# EAGLE design 6LED_controller (EAGLE 8.7.1)
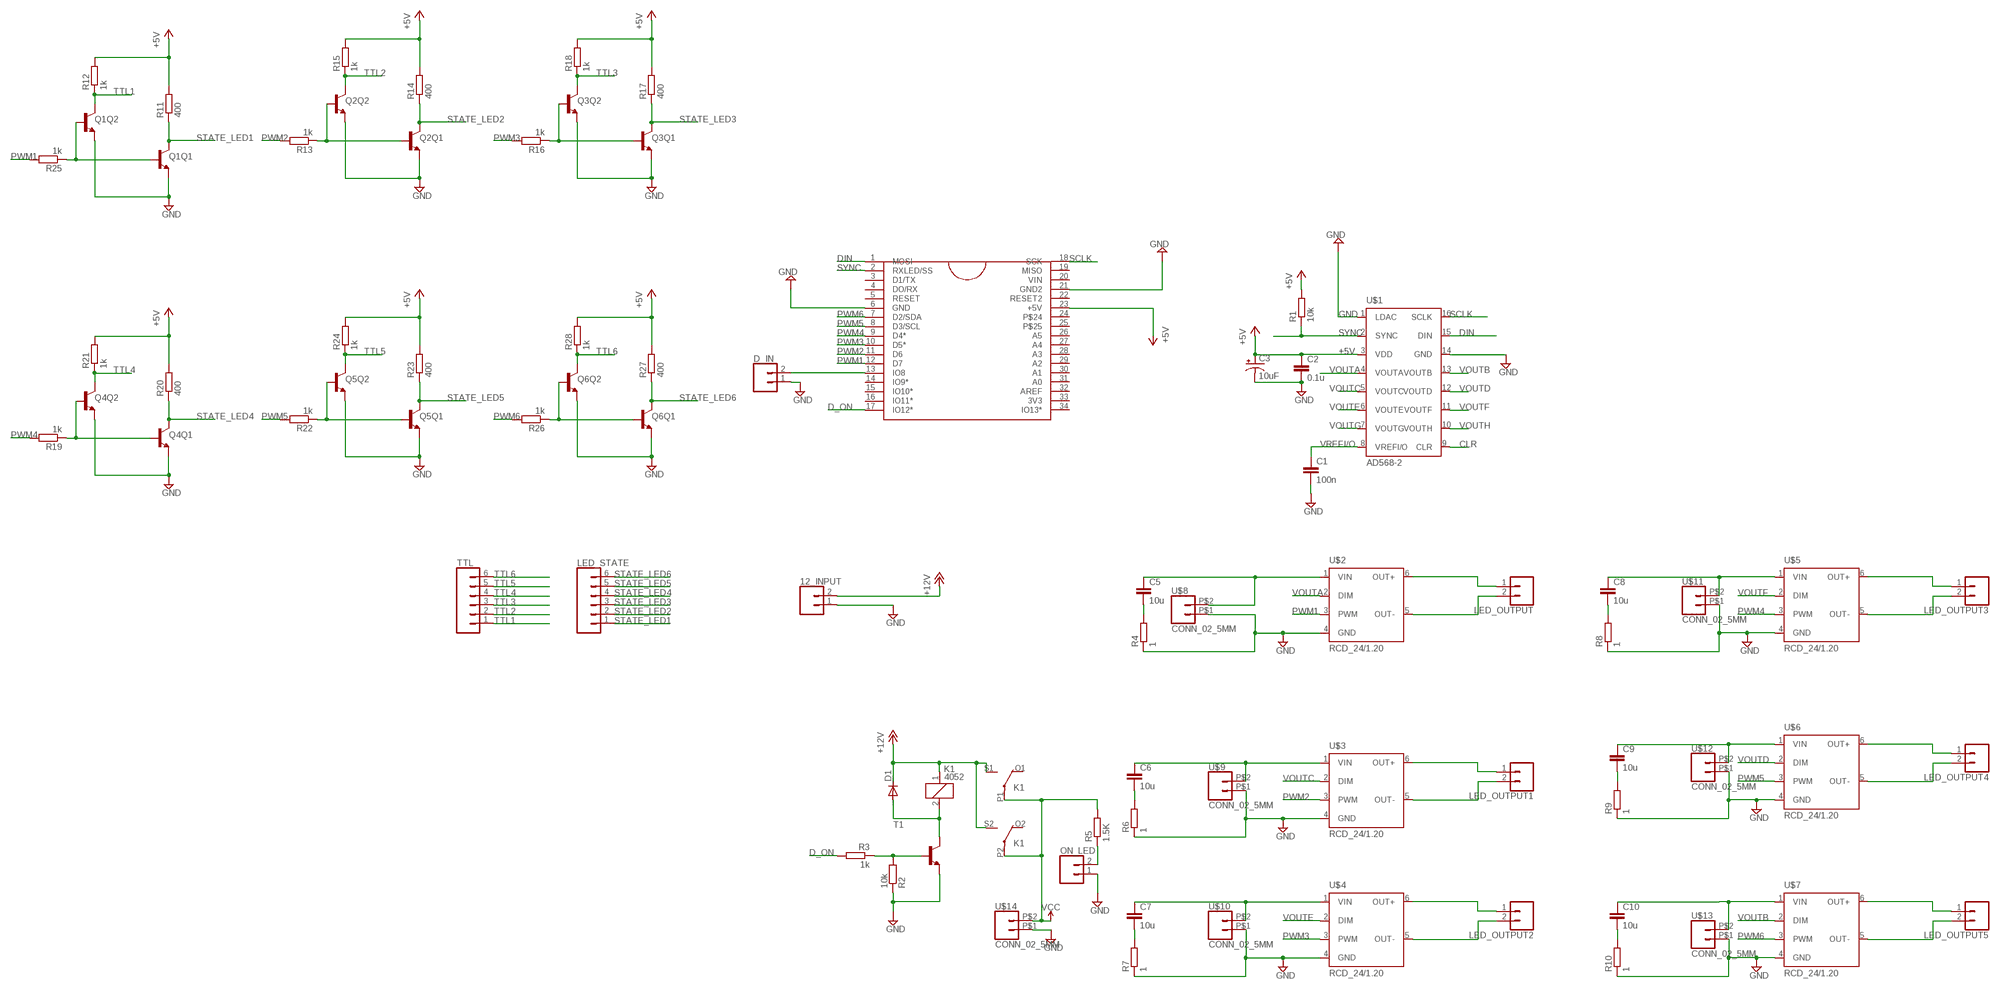
[diagram p0: schematic, sheet 1]

## Parts
12_INPUT  CONN_023.5MM  [SCREWTERMINAL-3.5MM-2]
C1  100n  C-EUC1206  [C1206]
C2  0.1u  C-EUC1206  [C1206]
C3  10uF  10UF-POLAR-EIA3528-20V-10%(TANT)  [EIA3528]
C5  10u  C-EUC1206  [C1206]
C6  10u  C-EUC1206  [C1206]
C7  10u  C-EUC1206  [C1206]
C8  10u  C-EUC1206  [C1206]
C9  10u  C-EUC1206  [C1206]
C10  10u  C-EUC1206  [C1206]
D1  DIODE-DO214AC  [DO214AC]
D_IN  CONN_02  [1X02]
K1  4052  [F4052]
LED_OUTPUT  CONN_023.5MM  [SCREWTERMINAL-3.5MM-2]
LED_OUTPUT1  CONN_023.5MM  [SCREWTERMINAL-3.5MM-2]
LED_OUTPUT2  CONN_023.5MM  [SCREWTERMINAL-3.5MM-2]
LED_OUTPUT3  CONN_023.5MM  [SCREWTERMINAL-3.5MM-2]
LED_OUTPUT4  CONN_023.5MM  [SCREWTERMINAL-3.5MM-2]
LED_OUTPUT5  CONN_023.5MM  [SCREWTERMINAL-3.5MM-2]
LED_STATE  CONN_06POLAR  [MOLEX-1X6]
ON_LED  CONN_02  [1X02]
Q1  TRANS_NPN_DUAL_NSM4002-MBT3904DW1T1  [SC70-6]
Q2  TRANS_NPN_DUAL_NSM4002-MBT3904DW1T1  [SC70-6]
Q3  TRANS_NPN_DUAL_NSM4002-MBT3904DW1T1  [SC70-6]
Q4  TRANS_NPN_DUAL_NSM4002-MBT3904DW1T1  [SC70-6]
Q5  TRANS_NPN_DUAL_NSM4002-MBT3904DW1T1  [SC70-6]
Q6  TRANS_NPN_DUAL_NSM4002-MBT3904DW1T1  [SC70-6]
R1  10k  R-EU_R1206  [R1206]
R2  10k  R-EU_R1206  [R1206]
R3  1k  R-EU_R0805  [R0805]
R4  1  R-EU_R2512  [R2512]
R5  1.5K  R-EU_R0805  [R0805]
R6  1  R-EU_R2512  [R2512]
R7  1  R-EU_R2512  [R2512]
R8  1  R-EU_R2512  [R2512]
R9  1  R-EU_R2512  [R2512]
R10  1  R-EU_R2512  [R2512]
R11  400  R-EU_R0805  [R0805]
R12  1k  R-EU_R0805  [R0805]
R13  1k  R-EU_R0805  [R0805]
R14  400  R-EU_R0805  [R0805]
R15  1k  R-EU_R0805  [R0805]
R16  1k  R-EU_R0805  [R0805]
R17  400  R-EU_R0805  [R0805]
R18  1k  R-EU_R0805  [R0805]
R19  1k  R-EU_R0805  [R0805]
R20  400  R-EU_R0805  [R0805]
R21  1k  R-EU_R0805  [R0805]
R22  1k  R-EU_R0805  [R0805]
R23  400  R-EU_R0805  [R0805]
R24  1k  R-EU_R0805  [R0805]
R25  1k  R-EU_R0805  [R0805]
R26  1k  R-EU_R0805  [R0805]
R27  400  R-EU_R0805  [R0805]
R28  1k  R-EU_R0805  [R0805]
T1  -NPN-SOT223  [SOT223]
TTL  CONN_06POLAR  [MOLEX-1X6]
U$1  AD568-2  [TSSOP-16]
U$2  RCD_24/1.20  [RCD-24/W/X3]
U$3  RCD_24/1.20  [RCD-24/W/X3]
U$4  RCD_24/1.20  [RCD-24/W/X3]
U$5  RCD_24/1.20  [RCD-24/W/X3]
U$6  RCD_24/1.20  [RCD-24/W/X3]
U$7  RCD_24/1.20  [RCD-24/W/X3]
U$8  CONN_02_5MM  [1X02_BIG_5MM]
U$9  CONN_02_5MM  [1X02_BIG_5MM]
U$10  CONN_02_5MM  [1X02_BIG_5MM]
U$11  CONN_02_5MM  [1X02_BIG_5MM]
U$12  CONN_02_5MM  [1X02_BIG_5MM]
U$13  CONN_02_5MM  [1X02_BIG_5MM]
U$14  CONN_02_5MM  [1X02_BIG_5MM]
U$20  ARDUINO_MICRO  [ARDUINO_MICRO_PADS]

## Nets
+5V: C2.1 C3.A(+) R1.2 R11.2 R12.2 R14.2 R15.2 R17.2 R18.2 R20.2 R21.2 R23.2 R24.2 R27.2 R28.2 U$1.3(VDD) U$20.23(+5V)
+12V: 12_INPUT.2 D1.C K1.1 K1.S1(2:S) K1.S2(3:S)
CLR: U$1.9(CLR)
D_ON: R3.2 U$20.17(IO12*)
DIN: U$1.15(DIN) U$20.1(MOSI)
GND: 12_INPUT.1 C1.2 C2.2 C3.C(-) D_IN.1 ON_LED.1 Q1.1(Q2:E) Q1.4(Q1:E) Q2.1(Q2:E) Q2.4(Q1:E) Q3.1(Q2:E) Q3.4(Q1:E) Q4.1(Q2:E) Q4.4(Q1:E) Q5.1(Q2:E) Q5.4(Q1:E) Q6.1(Q2:E) Q6.4(Q1:E) R2.1 R4.1 R6.1 R7.1 R8.1 R9.1 R10.1 T1.3(E) U$1.1(LDAC) U$1.14(GND) U$2.4(GND) U$3.4(GND) U$4.4(GND) U$5.4(GND) U$6.4(GND) U$7.4(GND) U$8.P$1 U$9.P$1 U$10.P$1 U$11.P$1 U$12.P$1 U$13.P$1 U$14.P$1 U$20.6(GND) U$20.21(GND2)
N$1: ON_LED.2 R5.1
N$2: LED_OUTPUT1.2 U$3.5(OUT-)
N$3: LED_OUTPUT1.1 U$3.6(OUT+)
N$4: C5.2 R4.2
N$5: LED_OUTPUT2.2 U$4.5(OUT-)
N$6: LED_OUTPUT.2 U$2.5(OUT-)
N$7: LED_OUTPUT.1 U$2.6(OUT+)
N$8: LED_OUTPUT2.1 U$4.6(OUT+)
N$9: Q1.2(Q2:B) Q1.5(Q1:B) R25.1
N$10: LED_OUTPUT3.2 U$5.5(OUT-)
N$11: LED_OUTPUT3.1 U$5.6(OUT+)
N$12: C6.2 R6.2
N$13: LED_OUTPUT4.2 U$6.5(OUT-)
N$14: D1.A K1.2 T1.4(C)
N$15: LED_OUTPUT4.1 U$6.6(OUT+)
N$16: R2.2 R3.1 T1.1(B)
N$17: LED_OUTPUT5.2 U$7.5(OUT-)
N$18: LED_OUTPUT5.1 U$7.6(OUT+)
N$19: C5.1 U$2.1(VIN) U$8.P$2
N$20: C6.1 U$3.1(VIN) U$9.P$2
N$21: C7.1 U$4.1(VIN) U$10.P$2
N$22: C8.1 U$5.1(VIN) U$11.P$2
N$23: C9.1 U$6.1(VIN) U$12.P$2
N$24: C10.1 U$7.1(VIN) U$13.P$2
N$25: Q2.2(Q2:B) Q2.5(Q1:B) R13.1
N$26: C7.2 R7.2
N$27: Q3.2(Q2:B) Q3.5(Q1:B) R16.1
N$28: C8.2 R8.2
N$29: Q4.2(Q2:B) Q4.5(Q1:B) R19.1
N$30: C9.2 R9.2
N$31: Q5.2(Q2:B) Q5.5(Q1:B) R22.1
N$32: C10.2 R10.2
N$33: Q6.2(Q2:B) Q6.5(Q1:B) R26.1
N$34: D_IN.2 U$20.13(IO8)
PWM1: R25.2 U$2.3(PWM) U$20.12(D7)
PWM2: R13.2 U$3.3(PWM) U$20.11(D6)
PWM3: R16.2 U$4.3(PWM) U$20.10(D5*)
PWM4: R19.2 U$5.3(PWM) U$20.9(D4*)
PWM5: R22.2 U$6.3(PWM) U$20.8(D3/SCL)
PWM6: R26.2 U$7.3(PWM) U$20.7(D2/SDA)
SCLK: U$1.16(SCLK) U$20.18(SCK)
STATE_LED1: LED_STATE.1 Q1.3(Q1:C) R11.1
STATE_LED2: LED_STATE.2 Q2.3(Q1:C) R14.1
STATE_LED3: LED_STATE.3 Q3.3(Q1:C) R17.1
STATE_LED4: LED_STATE.4 Q4.3(Q1:C) R20.1
STATE_LED5: LED_STATE.5 Q5.3(Q1:C) R23.1
STATE_LED6: LED_STATE.6 Q6.3(Q1:C) R27.1
SYNC: R1.1 U$1.2(SYNC) U$20.2(RXLED/SS)
TTL1: Q1.6(Q2:C) R12.1 TTL.1
TTL2: Q2.6(Q2:C) R15.1 TTL.2
TTL3: Q3.6(Q2:C) R18.1 TTL.3
TTL4: Q4.6(Q2:C) R21.1 TTL.4
TTL5: Q5.6(Q2:C) R24.1 TTL.5
TTL6: Q6.6(Q2:C) R28.1 TTL.6
VCC: K1.P1(2:P) K1.P2(3:P) R5.2 U$14.P$2
VOUTA: U$1.4(VOUTA) U$2.2(DIM)
VOUTB: U$1.13(VOUTB) U$7.2(DIM)
VOUTC: U$1.5(VOUTC) U$3.2(DIM)
VOUTD: U$1.12(VOUTD) U$6.2(DIM)
VOUTE: U$1.6(VOUTE) U$4.2(DIM)
VOUTF: U$1.11(VOUTF) U$5.2(DIM)
VOUTG: U$1.7(VOUTG)
VOUTH: U$1.10(VOUTH)
VREFI/O: C1.1 U$1.8(VREFI/O)
Unconnected: K1.O1(2:O) K1.O2(3:O) U$20.3(D1/TX) U$20.4(DO/RX) U$20.5(RESET) U$20.14(IO9*) U$20.15(IO10*) U$20.16(IO11*) U$20.19(MISO) U$20.20(VIN) U$20.22(RESET2) U$20.24 U$20.25 U$20.26(A5) U$20.27(A4) U$20.28(A3) U$20.29(A2) U$20.30(A1) U$20.31(A0) U$20.32(AREF) U$20.33(3V3) U$20.34(IO13*)

## Library data of the parts
12_INPUT LED_OUTPUT LED_OUTPUT1-LED_OUTPUT5 = SparkFun-Connectors:CONN_02: Multi connection point. Often used as Generic Header-pin footprint for 0.1 inch spaced/style header connections On any of the 0.1 inch spaced packages, you can populate with these: Break Away Headers - Straight <https://www.sparkfun.com/products/116> (PRT-00116) Break Away Male Headers - Right Angle <https://www.sparkfun.com/products/553> (PRT-00553) Female Headers <https://www.sparkfun.com/products/115> (PRT-00115) Break Away Headers - Machine Pin <https://www.sparkfun.com/products/117> (PRT-00117) Break Away Female Headers - Swiss Machine Pin <https://www.sparkfun.com/products/743> (PRT-00743) For SCREWTERMINALS and SPRING TERMINALS visit here: Screw Terimnals on SparkFun.com <https://www.sparkfun.com/search/results?term=Screw+Terminals> (5mm/3.5mm/2.54mm spacing) This device is also useful as a general connection point to wire up your design to another part of your project. Our various solder wires solder well into these plated through hole pads. Hook-Up Wire - Assortment (Stranded, 22 AWG) <https://www.sparkfun.com/products/11375> (PRT-11375) Hook-Up Wire - Assortment (Solid Core, 22 AWG) <https://www.sparkfun.com/products/11367> (PRT-11367) View the entire wire category on our website here <https://www.sparkfun.com/categories/141> Special notes: Molex polarized connector foot print use with: PRT-08233 with associated crimp pins and housings. 2.54_SCREWTERM for use with PRT-10571. 3.5mm Screw Terminal footprints for PRT-08084 5mm Screw Terminal footprints for use with PRT-08432; PROD_ID: CONN-08399
C1 C2 C5-C10 = rcl:C-EU: CAPACITOR, European symbol; SPICEPREFIX: C
C3 = SparkFun-Capacitors:10UF-POLAR: 10.0µF polarized capacitors A capacitor is a passive two-terminal electrical component used to store electrical energy temporarily in an electric field.; PROD_ID: CAP-08063
D1 = diode:DIODE-: DIODE
D_IN ON_LED = SparkFun-Connectors:CONN_02: Multi connection point. Often used as Generic Header-pin footprint for 0.1 inch spaced/style header connections On any of the 0.1 inch spaced packages, you can populate with these: Break Away Headers - Straight <https://www.sparkfun.com/products/116> (PRT-00116) Break Away Male Headers - Right Angle <https://www.sparkfun.com/products/553> (PRT-00553) Female Headers <https://www.sparkfun.com/products/115> (PRT-00115) Break Away Headers - Machine Pin <https://www.sparkfun.com/products/117> (PRT-00117) Break Away Female Headers - Swiss Machine Pin <https://www.sparkfun.com/products/743> (PRT-00743) For SCREWTERMINALS and SPRING TERMINALS visit here: Screw Terimnals on SparkFun.com <https://www.sparkfun.com/search/results?term=Screw+Terminals> (5mm/3.5mm/2.54mm spacing) This device is also useful as a general connection point to wire up your design to another part of your project. Our various solder wires solder well into these plated through hole pads. Hook-Up Wire - Assortment (Stranded, 22 AWG) <https://www.sparkfun.com/products/11375> (PRT-11375) Hook-Up Wire - Assortment (Solid Core, 22 AWG) <https://www.sparkfun.com/products/11367> (PRT-11367) View the entire wire category on our website here <https://www.sparkfun.com/categories/141> Special notes: Molex polarized connector foot print use with: PRT-08233 with associated crimp pins and housings. 2.54_SCREWTERM for use with PRT-10571. 3.5mm Screw Terminal footprints for PRT-08084 5mm Screw Terminal footprints for use with PRT-08432
K1 = relay:4052: RELAY 2 x switch, Finder; OC_FARNELL: unknown; OC_NEWARK: unknown
LED_STATE TTL = SparkFun-Connectors:CONN_06: Multi connection point. Often used as Generic Header-pin footprint for 0.1 inch spaced/style header connections On any of the 0.1 inch spaced packages, you can populate with these: Break Away Headers - Straight <https://www.sparkfun.com/products/116> (PRT-00116) Break Away Male Headers - Right Angle <https://www.sparkfun.com/products/553> (PRT-00553) Female Headers <https://www.sparkfun.com/products/115> (PRT-00115) Break Away Headers - Machine Pin <https://www.sparkfun.com/products/117> (PRT-00117) Break Away Female Headers - Swiss Machine Pin <https://www.sparkfun.com/products/743> (PRT-00743) Arduino Stackable Header - 6 Pin <https://www.sparkfun.com/products/9280> (PRT-09280) For SCREWTERMINALS and SPRING TERMINALS visit here: Screw Terimnals on SparkFun.com <https://www.sparkfun.com/search/results?term=Screw+Terminals> (5mm/3.5mm/2.54mm spacing) This device is also useful as a general connection point to wire up your design to another part of your project. Our various solder wires solder well into these plated through hole pads. Hook-Up Wire - Assortment (Stranded, 22 AWG) <https://www.sparkfun.com/products/11375> (PRT-11375) Hook-Up Wire - Assortment (Solid Core, 22 AWG) <https://www.sparkfun.com/products/11367> (PRT-11367) View the entire wire category on our website here <https://www.sparkfun.com/categories/141>
Q1-Q6 = SparkFun-DiscreteSemi:TRANS_NPN_DUAL_NSM4002: Dual NPN Transistors in Single Package The MBT3904W1 puts two general purpose 3904 NPN transistors in a single package. Datasheet <http://www.onsemi.com/pub_link/Collateral/MBT3904DW1T1-D.PDF> SparkFun Products: SparkFun ESP32 Thing <https://www.sparkfun.com/products/13907>; PROD_ID: TRANS-13337
R1-R28 = rcl:R-EU_: RESISTOR, European symbol; SPICEPREFIX: R
T1 = transistor-neu-to92:*-NPN-: NPN Transistror
U$1 = opto_stimulation:AD568-2
U$2-U$7 = opto_stimulation:RCD_24/1.20
U$8-U$14 = SparkFun-Connectors:CONN_02_5MM
U$20 = opto_stimulation:ARDUINO_MICRO; SPICEPREFIX: X

## Board
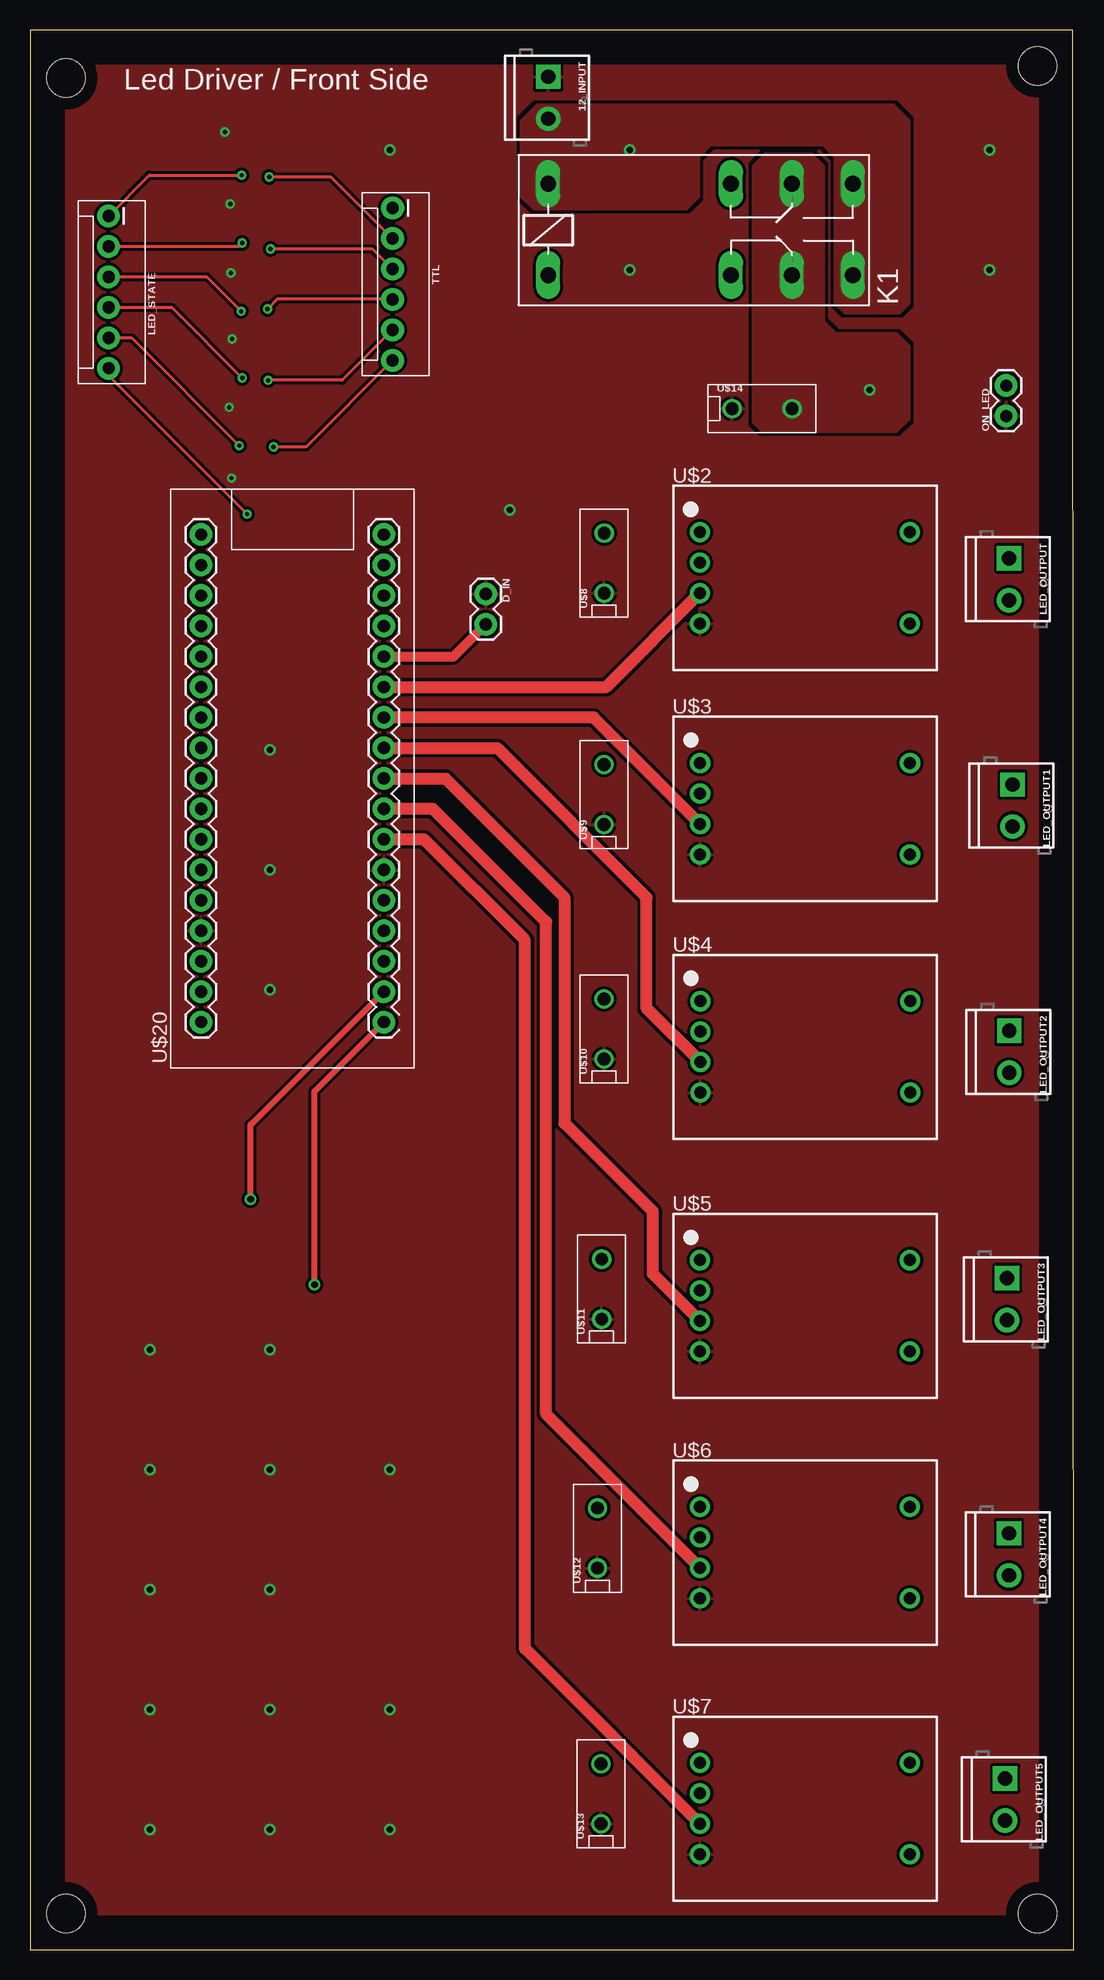
[diagram p1: board, top side]
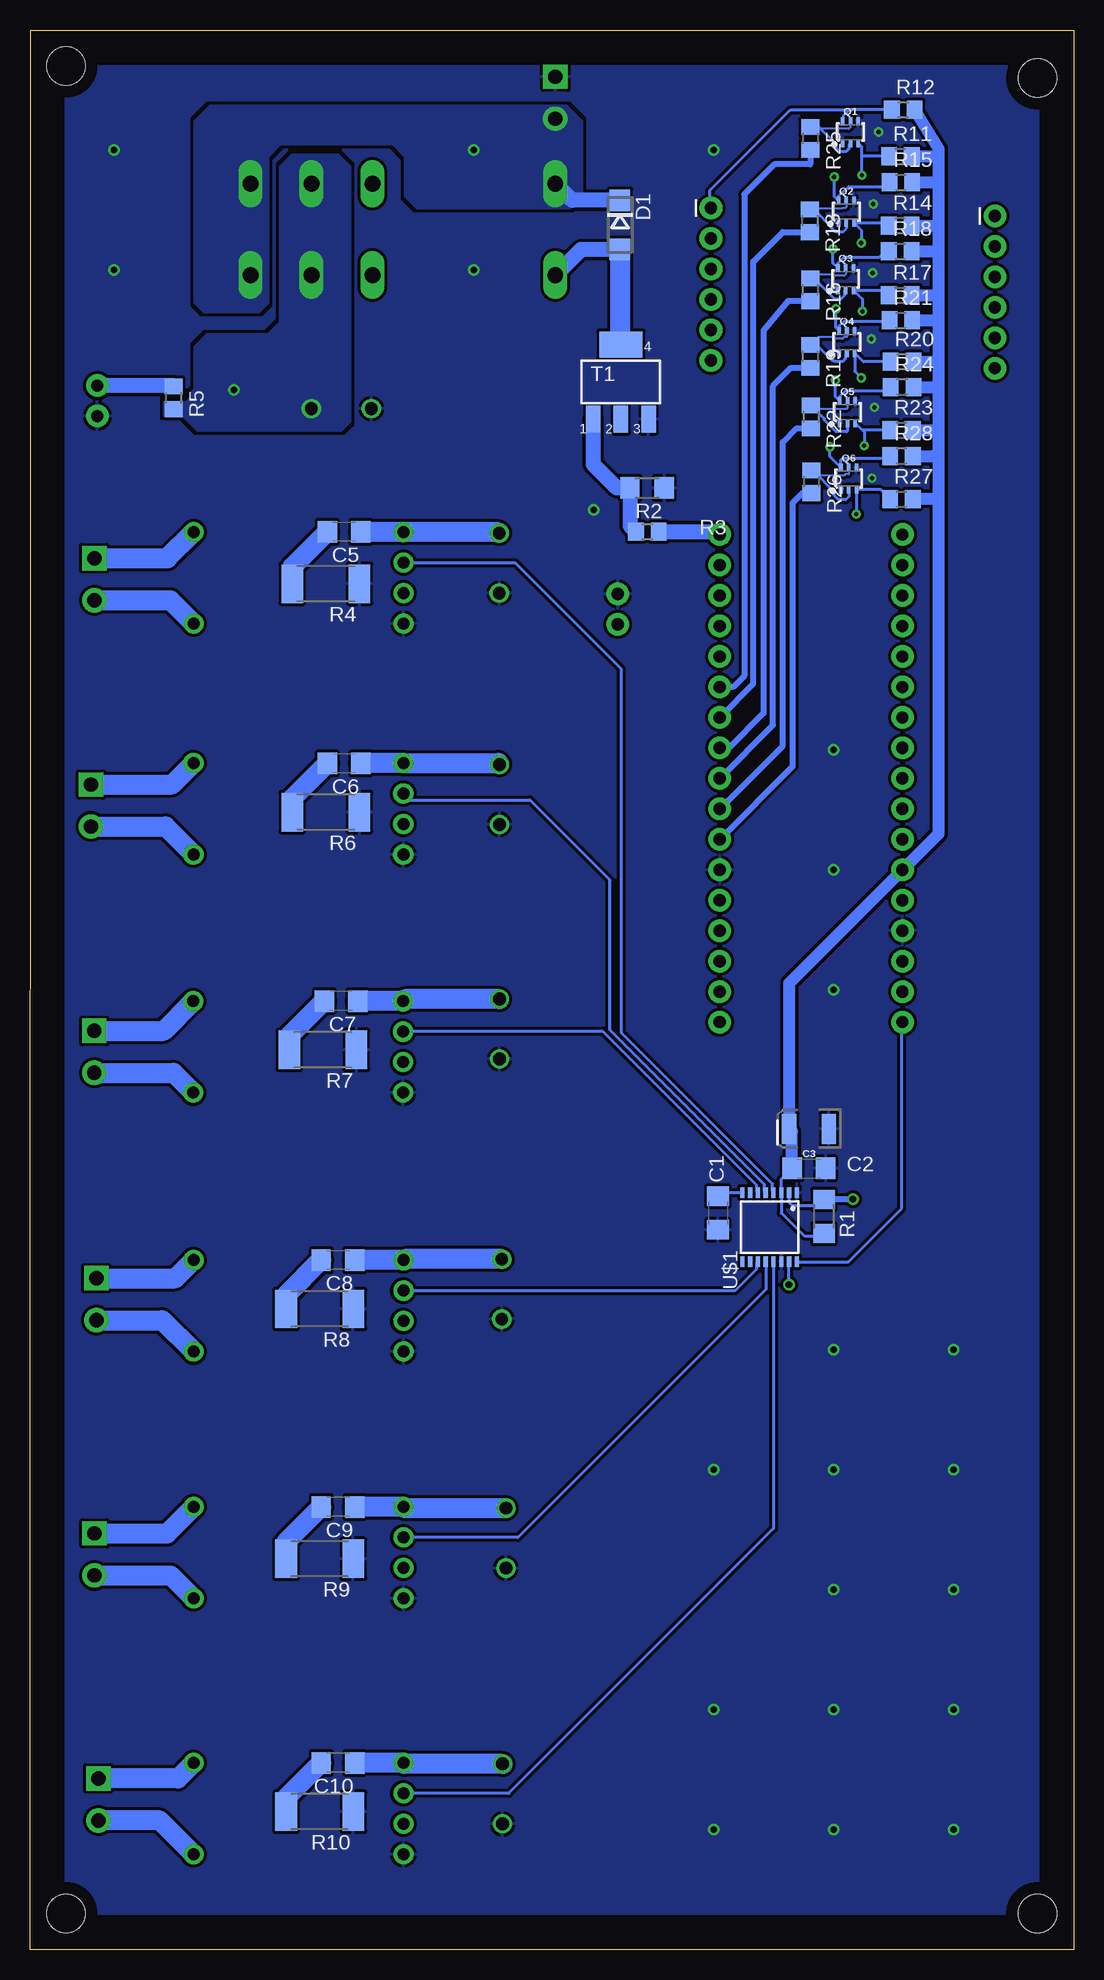
[diagram p2: board, bottom side, seen from below]

Size 87 x 160 mm. Coordinates in mm from the lower left corner, seen from the top.
Outline: 0,0 87,0 86.95,160 0,160 0,0
Copper layers (1*16): Top 0.035mm / dielectric 1.5mm / Bottom 0.035mm
Design rules "default *": minimum track width 6mil, minimum drill 0.35mm, track to track 10mil, track to pad 10mil, pad to pad 10mil, via to via 10mil, smd to smd 10mil, copper to edge 40mil, drill to drill 6mil, minimum pad ring 10mil, minimum via ring 8mil, stop-mask expansion 4mil, vias tented up to drill 0mil, thermal gap 10mil
Holes 3.2 mm at 3,3 84,3 3,156 84,157

### Footprints (pad centres in the part's own frame; a part is rotated, then mirrored left to right if it is on the bottom)
SCREWTERMINAL-3.5MM-2 = drill 1.2 pad 2.032 square: 1 0,0 | drill 1.2 pad 2.032: 2 3.5,0
C1206 = smd 1.6 x 1.8: 1 -1.4,0; 2 1.4,0
EIA3528 = smd 1.2 x 2.5: A 1.65,0; C -1.65,0
DO214AC = smd 1.8 x 1.7: A 2.05,0; C -2.05,0
1X02 = drill 1.016 pad 1.88: 1 0,0; 2 2.54,0
F4052 = drill 1.321 long: 1 -3.81,3.81; 2 -3.81,-3.81; O1 11.43,-3.81; O2 11.43,3.81; P1 16.51,-3.81; P2 16.51,3.81; S1 21.59,-3.81; S2 21.59,3.81
MOLEX-1X6 = drill 1.016 pad 1.88: 1 0,0; 2 2.54,0; 3 5.08,0; 4 7.62,0; 5 10.16,0; 6 12.7,0
SC70-6 = smd 0.3 x 0.66: 1 -0.65,-0.92; 2 0,-0.92; 3 0.65,-0.92; 4 0.65,0.92; 5 0,0.92; 6 -0.65,0.92
R1206 = smd 1.6 x 1.803: 1 -1.422,0; 2 1.422,0
R0805 = smd 1.3 x 1.5: 1 -0.95,0; 2 0.95,0
R2512 = smd 1.8 x 3.2: 1 -2.8,0; 2 2.8,0
SOT223 = smd 1.219 x 2.235: 1 -2.311,-3.099; 2 0,-3.099; 3 2.311,-3.099 | smd 3.6 x 2.2: 4 0,3.099
TSSOP-16 = smd 0.9 x 0.35: 1 -2.875,2.275; 2 -2.875,1.625; 3 -2.875,0.975; 4 -2.875,0.325; 5 -2.875,-0.325; 6 -2.875,-0.975; 7 -2.875,-1.625; 8 -2.875,-2.275; 9 2.875,-2.275; 10 2.875,-1.625; 11 2.875,-0.975; 12 2.875,-0.325; 13 2.875,0.325; 14 2.875,0.975; 15 2.875,1.625; 16 2.875,2.275
RCD-24/W/X3 = drill 1 pad 1.676: 1 -8.75,3.81; 2 -8.75,1.27; 3 -8.75,-1.27; 4 -8.75,-3.81; 5 8.75,-3.81; 6 8.75,3.81
1X02_BIG_5MM = drill 1.067: P$1 0,0; P$2 5,0
ARDUINO_MICRO_PADS = drill 1.016 pad 1.88: 1 0,0; 2 2.54,0; 3 5.08,0; 4 7.62,0; 5 10.16,0; 6 12.7,0; 7 15.24,0; 8 17.78,0; 9 20.32,0; 10 22.86,0; 11 25.4,0; 12 27.94,0; 13 30.48,0; 14 33.02,0; 15 35.56,0; 16 38.1,0; 17 40.64,0; 18 0,15.24; 19 2.54,15.24; 20 5.08,15.24; 21 7.62,15.24; 22 10.16,15.24; 23 12.7,15.24; 24 15.24,15.24; 25 17.78,15.24; 26 20.32,15.24; 27 22.86,15.24; 28 25.4,15.24; 29 27.94,15.24; 30 30.48,15.24; 31 33.02,15.24; 32 35.56,15.24; 33 38.1,15.24; 34 40.64,15.24

### Placement (x,y rotation side)
12_INPUT  43.2,156.1 270 top
C1  29.65,61.39 270 bottom
C2  22.07,65.11 0 bottom
C3  22.05,68.41 180 bottom
C5  60.81,118.17 180 bottom
C6  60.81,98.86 180 bottom
C7  61.06,79.05 180 bottom
C8  61.32,57.46 180 bottom
C9  61.32,36.89 180 bottom
C10  61.32,15.55 180 bottom
D1  37.82,143.75 270 bottom
D_IN  38,113 270 top
K1  47.02,143.38 0 top
LED_OUTPUT  81.63,115.97 270 top
LED_OUTPUT1  81.92,97.11 270 top
LED_OUTPUT2  81.64,76.57 270 top
LED_OUTPUT3  81.47,55.95 270 top
LED_OUTPUT4  81.61,34.68 270 top
LED_OUTPUT5  81.31,14.26 270 top
LED_STATE  6.55,144.5 270 top
ON_LED  81.38,127.82 90 top
Q1  18.6,151.5 0 bottom
Q2  18.95,144.85 0 bottom
Q3  19,139.25 0 bottom
Q4  18.9,134 0 bottom
Q5  18.85,128.15 0 bottom
Q6  18.75,122.6 0 bottom
R1  20.8,61.1 270 bottom
R2  35.55,121.83 180 bottom
R3  35.53,118.18 0 bottom
R4  62.33,113.85 180 bottom
R5  75.03,129.34 270 bottom
R6  62.33,94.8 180 bottom
R7  62.59,74.99 180 bottom
R8  62.84,53.4 180 bottom
R9  62.84,32.57 180 bottom
R10  62.84,11.49 180 bottom
R11  14.43,149.47 0 bottom
R12  14.2,153.35 0 bottom
R13  22,144.1 270 bottom
R14  14.45,143.7 0 bottom
R15  14.4,147.3 0 bottom
R16  21.95,138.35 270 bottom
R17  14.45,137.9 0 bottom
R18  14.45,141.55 0 bottom
R19  21.95,132.8 270 bottom
R20  14.3,132.35 0 bottom
R21  14.4,135.8 0 bottom
R22  21.9,127.75 270 bottom
R23  14.35,126.65 0 bottom
R24  14.3,130.25 0 bottom
R25  21.94,150.96 270 bottom
R26  21.85,122.35 270 bottom
R27  14.35,120.9 0 bottom
R28  14.35,124.5 0 bottom
T1  37.74,130.67 0 bottom
TTL  30.23,145.16 270 top
U$1  25.33,60.2 270 bottom
U$2  64.62,114.33 0 top
U$3  64.62,95.09 0 top
U$4  64.64,75.23 0 top
U$5  64.62,53.65 0 top
U$6  64.62,33.08 0 top
U$7  64.62,11.74 0 top
U$8  47.87,113.06 90 top
U$9  47.86,93.78 90 top
U$10  47.86,74.22 90 top
U$11  47.66,52.54 90 top
U$12  47.32,31.78 90 top
U$13  47.6,10.47 90 top
U$14  58.54,128.44 0 top
U$20  29.5,77.3 90 top

### Tracks (layer width: path | path; a pad name or v marks a point on that pad's centre or on a via)
+5V
  Bottom 0.254: R1.2 20.98,59.49 22.46,59.49 24.36,61.4 U$1.3 24.36,64.22 C2.1
  Bottom 1.016: C2.1 23.47,68.17 C3.A 23.7,80.56 U$20.23 11.25,93.01 11.25,120.95 | 11.25,120.95 11.25,124.9 | 11.25,124.9 11.25,126.55 | 11.25,126.55 11.25,130.5 | 11.25,130.5 11.25,132.1 | 11.25,132.1 11.25,136.1 | 11.25,136.1 11.25,138.05 | 11.25,138.05 11.25,141.6 | 11.25,141.6 11.25,143.5 | 11.25,143.5 11.25,147.35 | 11.25,147.35 11.25,149.4 | 11.25,149.4 11.25,150.1 R12.2 | R27.2 13.35,120.95 11.25,120.95 | R28.2 11.65,124.5 11.25,124.9 | R23.2 11.35,126.65 11.25,126.55 | R24.2 11.5,130.25 11.25,130.5 | R20.2 11.5,132.35 11.25,132.1 | R21.2 11.55,135.8 11.25,136.1 | R17.2 11.4,137.9 11.25,138.05 | R18.2 11.3,141.55 11.25,141.6 | R14.2 11.45,143.7 11.25,143.5 | R15.2 11.3,147.3 11.25,147.35 | R11.2 11.32,149.47 11.25,149.4
+12V  (via drill 0.55)
  Bottom 1.27: D1.C 41.81,145.8 K1.1
  other vias: 50,150
  pour Bottom (isolate 0.61, no thermals): 72.49,136.45 73.26,137.22 73.26,137.47 73.26,152.46 71.99,153.73 42.27,153.73 41,152.46 41,146.11 42.01,145.09 54.71,145.09 55.73,146.11 55.73,149.41 56.75,150.42 66.14,150.42 67.16,149.41 67.16,137.22 67.92,136.45 68.18,136.45
  pour Top (no thermals): 41,146.11 42.01,145.09 54.71,145.09 55.73,146.11 55.73,149.41 56.75,150.42 66.14,150.42 67.16,149.41 67.16,137.22 67.92,136.45 72.49,136.45 73.26,137.22 73.26,152.46 71.99,153.73 42.27,153.73 41,152.46
D_ON
  Bottom 1.27: R3.2 29.74,118.18 U$20.17
DIN  (via drill 0.55)
  Top 0.508: v23.73,55.43 23.73,71.53 U$20.1
  Bottom 0.254: v23.73,55.43 23.71,55.44 U$1.15
GND  (via drill 0.35, 0.55)
  Bottom 0.254: 19.28,121.8 Q6.1
  other vias: 20,90 20,80 20,50 20,40 20,30 20,20 20,10 30,10 30,20 30,40 80,140 80,150 16.8,122.65 16.6,128.55 16.85,134.25 16.75,139.75 16.7,145.5 16.25,151.5 20,100 10,50 10,40 10,30 10,20 10,10 30,150 50,140 40,120
  pour Top (rank 2): 3,157 3,3 84,3 84,157
  pour Bottom (rank 2): 3,157 3,3 84,3 84,157
N$1
  Bottom 1.27: R5.1 75.1,130.36 ON_LED.2
N$2
  Bottom 1.651: LED_OUTPUT1.2 75.7,93.61 U$3.5
N$3
  Bottom 1.651: LED_OUTPUT1.1 75.16,97.11 U$3.6
N$4
  Bottom 1.651: C5.2 65.13,115.24 R4.2
N$5
  Bottom 1.651: LED_OUTPUT2.2 75.04,73.07 U$4.5
N$6
  Bottom 1.651: LED_OUTPUT.2 75.31,112.47 U$2.5
N$7
  Bottom 1.651: LED_OUTPUT.1 75.54,115.97 U$2.6
N$8
  Bottom 1.651: LED_OUTPUT2.1 75.86,76.57 U$4.6
N$9
  Bottom 0.152: Q1.5 18.6,151.89 18.73,151.76 21.79,151.76 R25.1
  Bottom 0.254: Q1.2 18.72,150.46 18.72,150.09 18.94,149.87 19.13,149.87 19.15,149.85 19.17,149.87 19.56,149.87 19.78,150.09 19.78,150.48 21.21,151.91 R25.1
N$10
  Bottom 1.651: LED_OUTPUT3.2 75.98,52.45 U$5.5
N$11
  Bottom 1.651: LED_OUTPUT3.1 74.88,55.95 U$5.6
N$12
  Bottom 1.651: C6.2 65.13,95.94 R6.2
N$13
  Bottom 1.651: LED_OUTPUT4.2 75.29,31.18 U$6.5
N$14
  Bottom 1.27: D1.A 41.08,141.7 K1.2
  Bottom 1.651: D1.A 37.82,133.85 T1.4
N$15
  Bottom 1.651: LED_OUTPUT4.1 75.57,34.68 U$6.6
N$16
  Bottom 1.27: T1.1 40.05,123.8 38.1,121.85 36.99,121.85 R2.2 36.97,118.67 R3.1
N$17
  Bottom 1.651: U$7.5 76.2,10.76 LED_OUTPUT5.2
N$18
  Bottom 1.651: U$7.6 74.66,14.26 LED_OUTPUT5.1
N$19
  Bottom 1.651: U$8.P$2 47.95,118.14 U$2.1 59.39,118.14 C5.1
N$20
  Bottom 1.651: C6.1 59.37,98.9 U$3.1 47.97,98.9 U$9.P$2
N$21
  Bottom 1.651: U$10.P$2 55.71,79.22 U$4.1 C7.1
N$22
  Bottom 1.651: C8.1 U$5.1 55.79,57.54 U$11.P$2
N$23
  Bottom 1.651: C9.1 U$6.1 55.77,36.78 U$12.P$2
N$24
  Bottom 1.651: C10.1 U$7.1 55.79,15.47 U$13.P$2
N$25
  Bottom 0.152: 21.94,145.11 R13.1 | Q2.5 18.95,145.24 19.03,145.17 19.26,145.17 19.31,145.11 21.81,145.11 21.88,145.18
  Bottom 0.254: Q2.2 18.95,143.45 19.25,143.15 19.75,143.15 19.82,143.22 19.91,143.22 20.13,143.44 20.13,143.53 21.53,144.93 21.88,144.93 | 21.88,144.93 R13.1 21.88,145.18 21.88,144.93
N$26
  Bottom 1.651: C7.2 65.39,76.13 R7.2
N$27
  Bottom 0.152: Q3.5 19,139.63 19.12,139.51 19.94,139.51 20.03,139.6 21.65,139.6 R16.1
  Bottom 0.254: Q3.2 19.12,138.21 19.12,137.84 19.41,137.55 19.9,137.55 21.65,139.3 R16.1
N$28
  Bottom 1.651: C8.2 65.64,54.54 R8.2
N$29
  Bottom 0.152: Q4.5 18.9,134.4 19.13,134.4 19.26,134.26 19.84,134.26 19.97,134.4 21.3,134.4 R19.1
  Bottom 0.254: Q4.2 19.02,132.96 19.02,132.59 19.24,132.37 19.86,132.37 19.89,132.4 20.05,132.4 21.4,133.75 R19.1
N$30
  Bottom 1.651: C9.2 65.64,33.96 R9.2
N$31
  Bottom 0.152: Q5.5 18.85,128.5 18.94,128.41 21.61,128.41 R22.1
  Bottom 0.254: Q5.2 18.85,126.6 18.93,126.52 19.81,126.52 20.77,127.48 20.77,127.61 20.99,127.83 21.03,127.83 R22.1
N$32
  Bottom 1.651: C10.2 65.64,12.63 R10.2
N$33
  Bottom 0.152: Q6.5 18.75,122.97 19.01,122.97 19.11,122.86 21.33,122.86 21.77,123.3
  Bottom 0.254: Q6.2 18.75,121.1 19,120.85 19.59,120.85 19.93,121.19 19.93,121.48 21.75,123.3 21.77,123.3 R26.1
N$34
  Top 0.813: U$20.13 35.32,107.78 D_IN.2
PWM1
  Top 1.016: U$2.3 48.04,105.24 U$20.12
  Bottom 0.508: R25.2 21.95,148.8 24.95,148.8 27.45,146.3 27.45,106.15 28.36,105.24 U$20.12
PWM2
  Top 1.016: U$3.3 46.99,102.7 U$20.11
  Bottom 0.508: U$20.11 26.69,105.51 26.69,140.7 24.24,143.15 R13.2
PWM3
  Top 0.254: U$20.10 29.69,100.32 29.69,100.13
  Top 1.016: 29.53,100.13 29.69,100.13 38.97,100.13 51.41,87.69 51.41,78.44 U$4.3
  Bottom 0.508: R16.2 23.8,137.4 25.85,134.95 25.85,103.05 28.74,100.16 U$20.10
PWM4
  Top 0.254: U$20.9 29.69,97.78 29.69,97.59
  Top 1.016: 29.53,97.59 29.69,97.59 34.65,97.59 44.55,87.69 44.55,68.89 51.92,61.52 51.92,56.33 U$5.3
  Bottom 0.508: U$20.9 25.05,102.07 25.05,130.35 23.55,131.85 R19.2
PWM5
  Top 1.016: U$20.8 33.6,95.08 43.03,85.65 43.03,44.65 U$6.3
  Bottom 0.508: U$20.8 24.25,100.33 24.25,125.65 23.1,126.8 R22.2
PWM6
  Top 1.016: U$20.7 32.84,92.54 41.25,84.13 41.25,25.09 U$7.3
  Bottom 0.508: U$20.7 23.4,98.64 23.4,120.6 22.6,121.4 R26.2
SCLK
  Bottom 0.254: U$1.16 18.78,57.33 14.33,61.78 14.33,77.23 U$20.18
STATE_LED1  (via drill 0.35)
  Top 0.254: LED_STATE.1 9.95,147.9 v17.65,147.9
  Bottom 0.254: Q1.3 17.65,150.28 17.65,149.45 | v17.65,147.9 17.65,149.45 | R11.1 17.63,149.47 17.65,149.45
STATE_LED2  (via drill 0.35)
  Top 0.254: LED_STATE.2 17.41,141.96 v17.7,142.25
  Bottom 0.254: v17.7,142.25 17.7,143.33 Q2.3 15.63,143.93 R14.1
STATE_LED3  (via drill 0.35)
  Top 0.254: LED_STATE.3 14.73,139.42 v17.6,136.55
  Bottom 0.254: v17.6,136.55 17.6,137.58 Q3.3 15.83,138.33 R17.1
STATE_LED4  (via drill 0.35)
  Top 0.254: LED_STATE.4 11.82,136.88 v17.7,131
  Bottom 0.254: v17.7,131 18.25,131.55 Q4.3 17.52,132.35 R20.1
STATE_LED5  (via drill 0.35)
  Top 0.254: LED_STATE.5 8.46,134.34 v17.45,125.35
  Bottom 0.254: v17.45,125.35 17.45,126.48 Q5.3 17.62,126.65 R23.1
STATE_LED6  (via drill 0.35)
  Top 0.254: LED_STATE.6 6.55,131.2 v18.1,119.65
  Bottom 0.254: v18.1,119.65 Q6.3 16.08,121.68 R27.1
SYNC  (via drill 0.55)
  Top 0.508: v18.39,62.54 18.39,68.73 U$20.2
  Bottom 0.254: U$1.2 23.71,62.27 23.47,62.03 21.29,62.03 R1.1
  Bottom 0.508: v18.39,62.54 20.78,62.54 R1.1
TTL1
  Bottom 0.254: Q1.6 19.23,152.44 19.23,152.81 18.69,153.35 | R12.1 18.45,153.35 18.69,153.35 | TTL.1 30.3,145.23 30.3,146.65 23.6,153.35 18.69,153.35
TTL2  (via drill 0.35)
  Top 0.254: TTL.2 25.1,147.75 v19.95,147.75
  Bottom 0.254: v19.95,147.75 19.95,146.12 Q2.6 19.6,146.14 19.26,146.48 19.22,146.48 18.75,146.95 15.7,146.95 R15.1
TTL3  (via drill 0.35)
  Top 0.254: TTL.3 28.56,141.75 v20.05,141.75
  Bottom 0.254: v20.05,141.75 20.05,140.57 Q3.6 19.65,140.55 19.15,141.05 16.2,141.05 15.7,141.55 R18.1
TTL4  (via drill 0.35)
  Top 0.254: TTL.4 20.59,137.54 v19.8,136.75
  Bottom 0.254: v19.8,136.75 19.8,135.17 Q4.6 19.55,135.3 19.1,135.75 15.4,135.75 R21.1
TTL5  (via drill 0.35)
  Top 0.254: TTL.5 26.03,130.8 v19.85,130.8
  Bottom 0.254: v19.85,130.8 19.85,129.42 Q5.6 19.48,129.09 19.48,129.46 18.99,129.95 15.55,129.95 R24.1
TTL6  (via drill 0.35)
  Top 0.254: TTL.6 23.02,125.25 v20.3,125.25
  Bottom 0.254: v20.3,125.25 20.3,124.42 Q6.6 19.4,124.15 19.25,124.3 15.5,124.3 R28.1
VCC  (via drill 0.55)
  other vias: 70,130
  pour Bottom (isolate 0.61, no thermals): 61.32,149.66 60.3,148.65 60.3,127.31 61.06,126.55 73,126.55 74.27,127.82 75.8,127.82 75.8,129.09 74.27,129.09 73.26,130.1 73.26,133.66 72.24,134.68 67.16,134.68 66.14,135.69 66.14,148.65 65.13,149.66
  pour Top (no thermals): 60.3,148.65 61.32,149.66 65.13,149.66 66.14,148.65 66.14,135.69 67.16,134.68 72.24,134.68 73.26,133.66 73.26,127.56 72.24,126.55 61.06,126.55 60.3,127.31
VOUTA
  Bottom 0.254: U$2.2 46.56,115.6 37.7,106.74 37.7,76.41 25.1,63.82 25.1,63.17 U$1.4
VOUTB
  Bottom 0.254: U$1.13 25.01,35.09 47.09,13.01 U$7.2
VOUTC
  Bottom 0.254: U$3.2 55.33,95.81 45.32,95.81 38.64,89.14 38.64,76.64 25.75,63.75 25.75,63.17 U$1.5
VOUTD
  Bottom 0.254: U$1.12 25.66,55.02 46.33,34.35 U$6.2
VOUTE
  Bottom 0.254: U$1.6 26.4,63.17 26.4,63.68 39.22,76.5 U$4.2
VOUTF
  Bottom 0.254: U$1.11 26.4,57.23 26.4,56.72 28.2,54.92 U$5.2
VREFI/O
  Bottom 0.254: U$1.8 29.37,63.08 C1.1

### Text on the board
tNames: Led Driver / Front Side